# EasyEDA schematic SCH_POC-QTR-8A_2022-11-29.json
TITLE: POC_QTR-8A; REV: 1.0; Date: 2022-11-25; Sheet: 1/1; Drawn By: milanvannieuwenhuyze; Company: HoGent
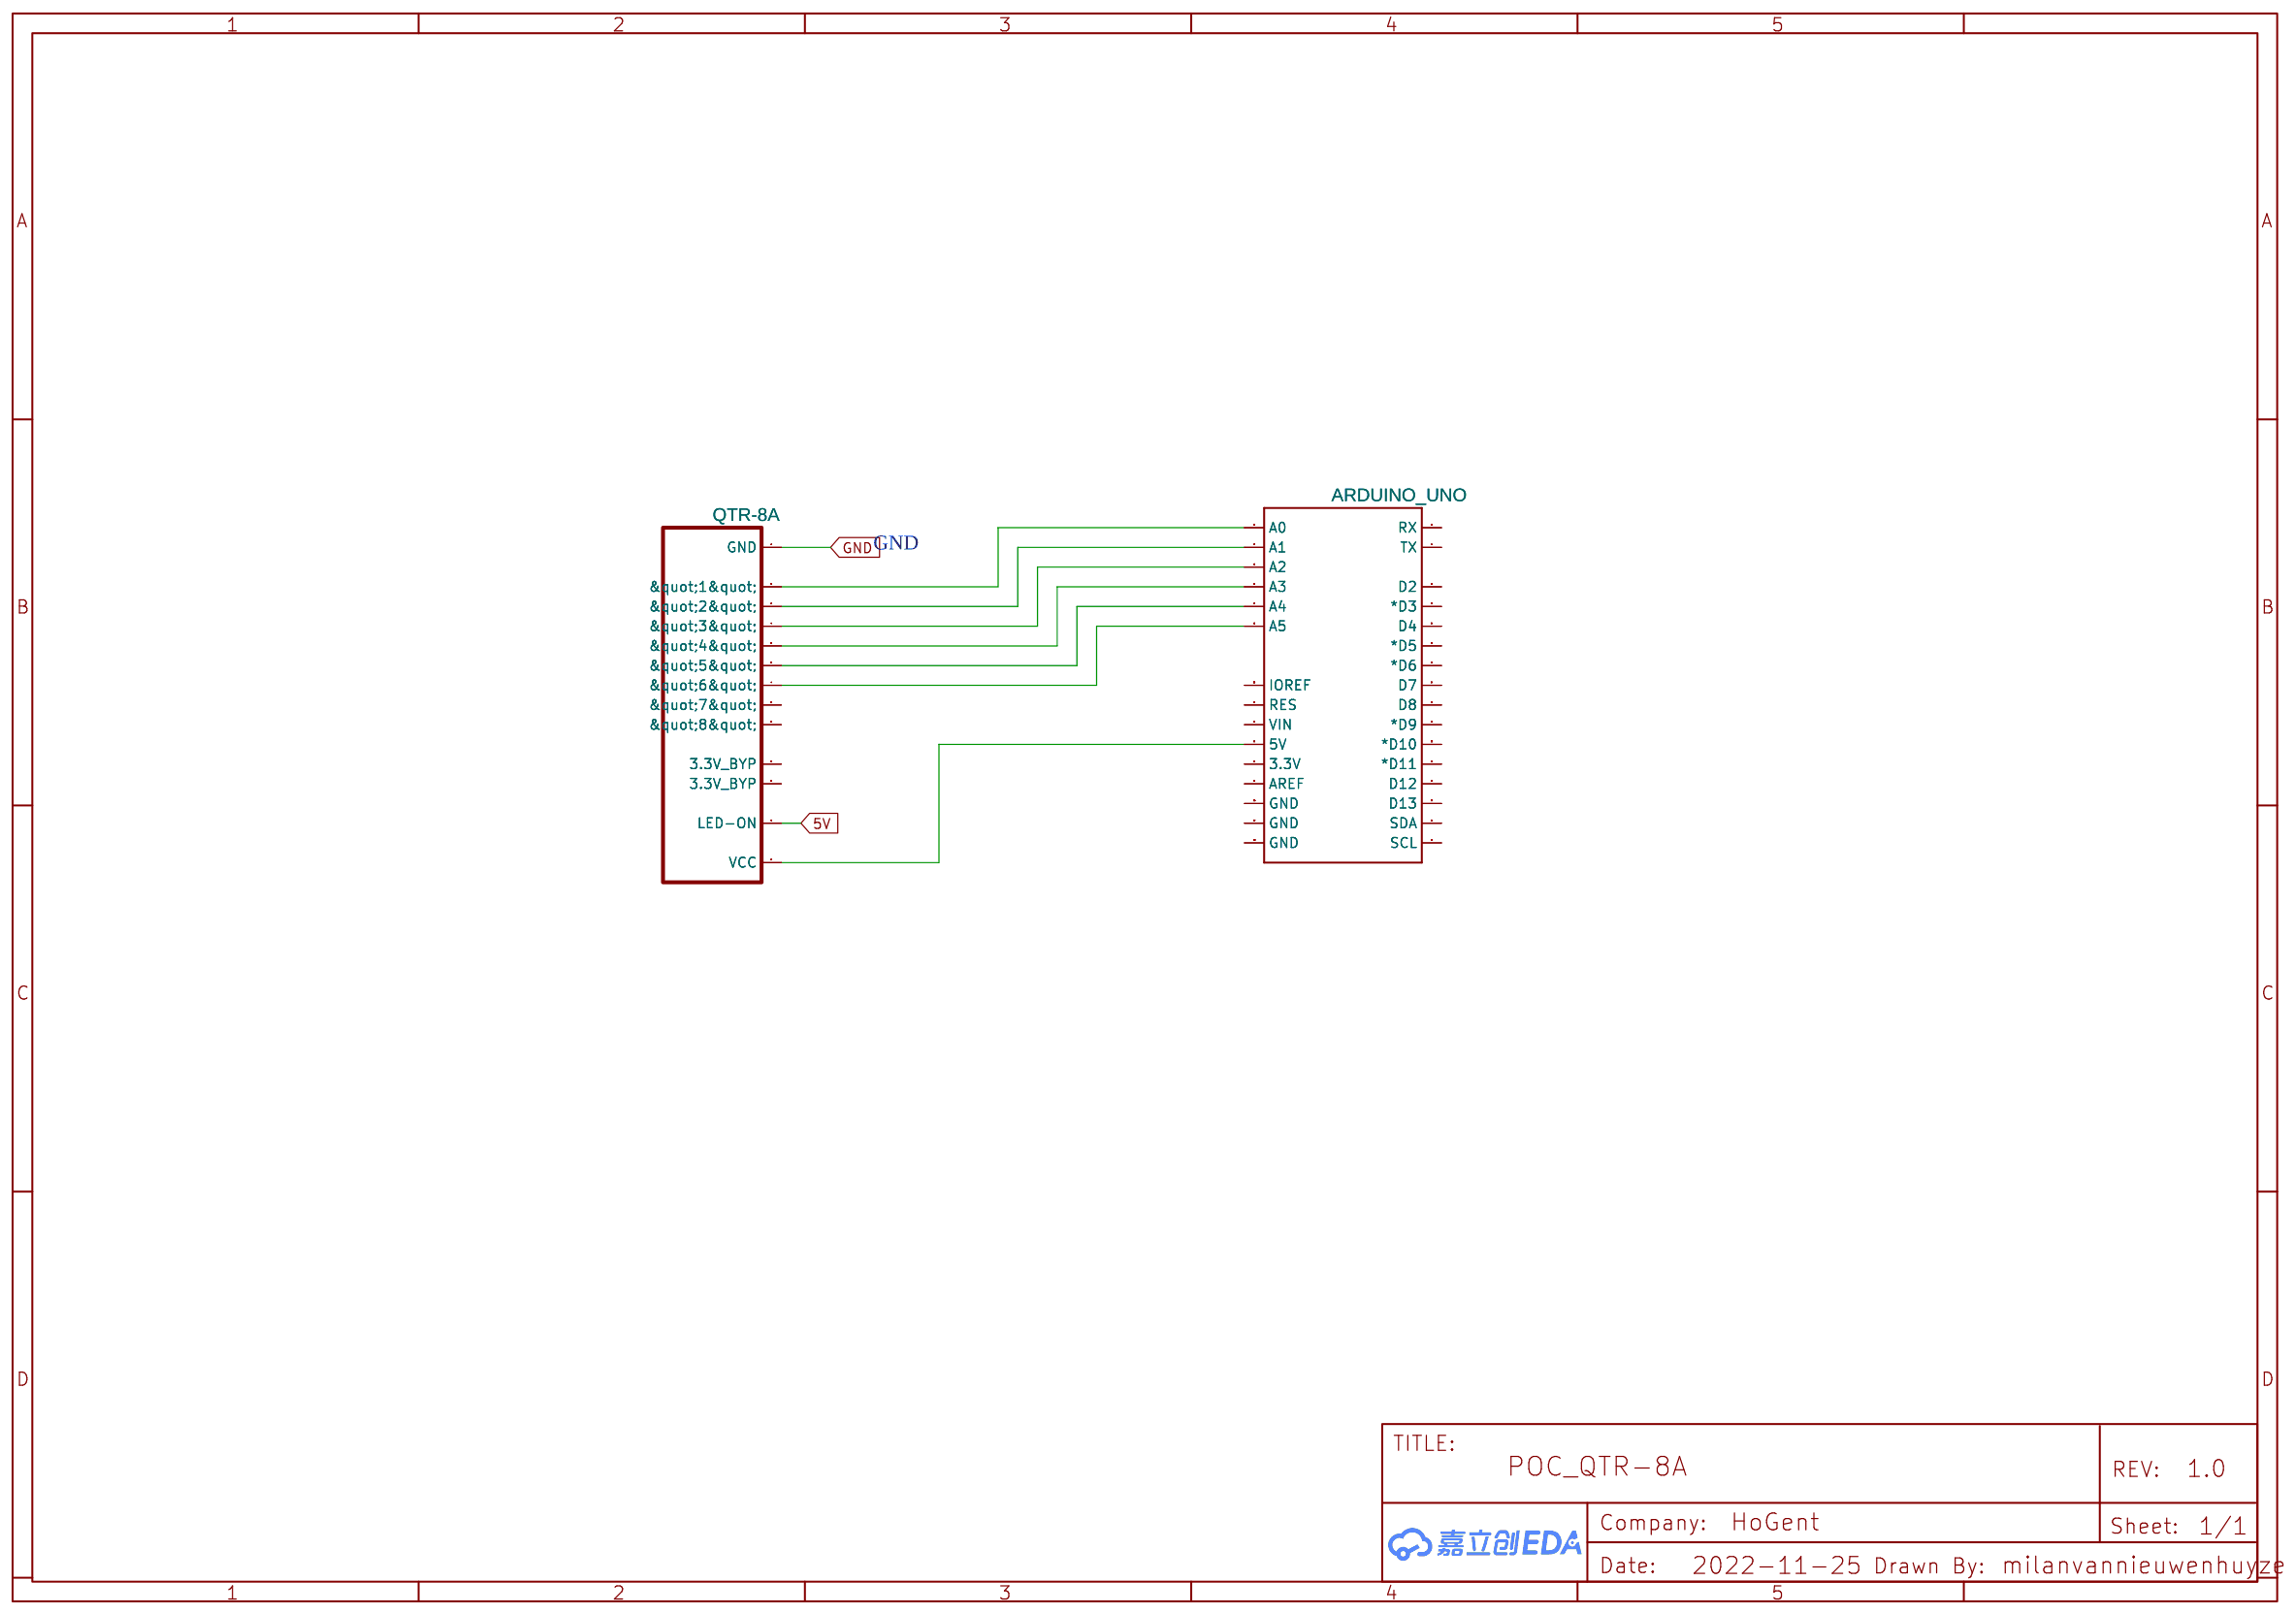
[diagram p0: schematic sheet]

## Parts
U1  ARDUINO_UNO  [UNO_R3_SHIELD_NOLABELS]
U2  QTR-8A  [QTR-8A/8RC]

## Library data of the parts
U1 = ARDUINO_R3_SHIELD: Contributor: SparkFun
U2 = QTR-8A: Manufacturer: Pololu; Supplier: Pololu; Supplier Part: 960; link: https://www.pololu.com/docs/pdf/0J12/QTR-8x.pdf; Contributor: Junikos

## Nets
5V: U1.5V U2.12(LED-ON)
GND: U2.1(GND)
Net-(U1-A0): U1.A0 U2.2("1")
Net-(U1-A1): U1.A1 U2.3("2")
Net-(U1-A2): U1.A2 U2.4("3")
Net-(U1-A3): U1.A3 U2.5("4")
Net-(U1-A4): U1.A4 U2.6("5")
Net-(U1-A5): U1.A5 U2.7("6")

Not connected (* = marked no-connect by the designer): U1 3.3V AREF D2 D3(*D3) D4 D5(*D5) D6(*D6) D7 D8 D9(*D9) D10(*D10) D11(*D11) D12 D13 GND@0(GND) GND@1(GND) GND@2(GND) IOREF RES RX SCL SDA TX VIN; U2 8("7") 9("8") 10(3.3V BYP) 11(3.3V BYP)

## Notes on the sheet
- GND
